# EAGLE board SVCSYNTH00 (EAGLE 7.7.0), part 1 of 2
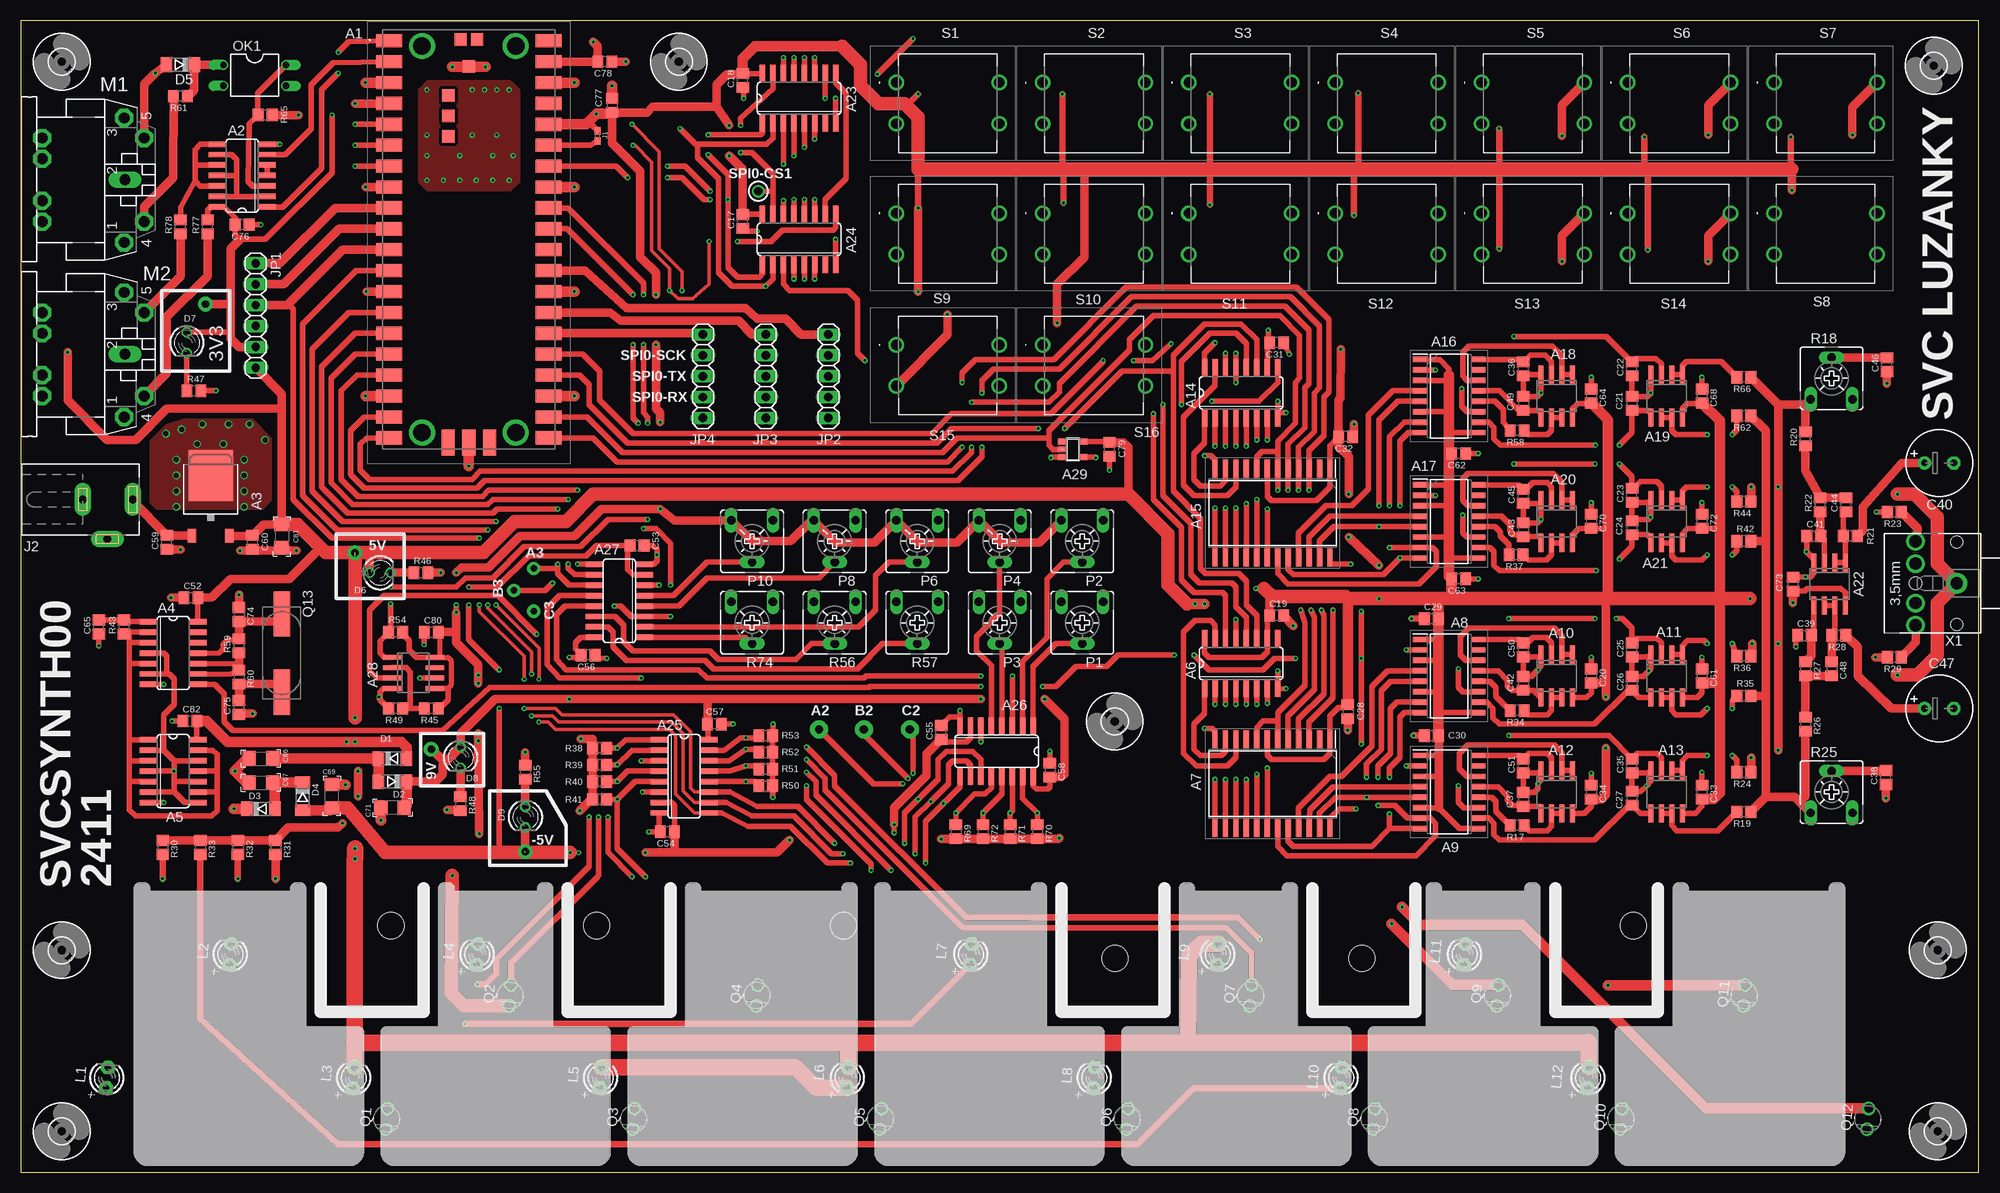
[diagram p4: board, top side]
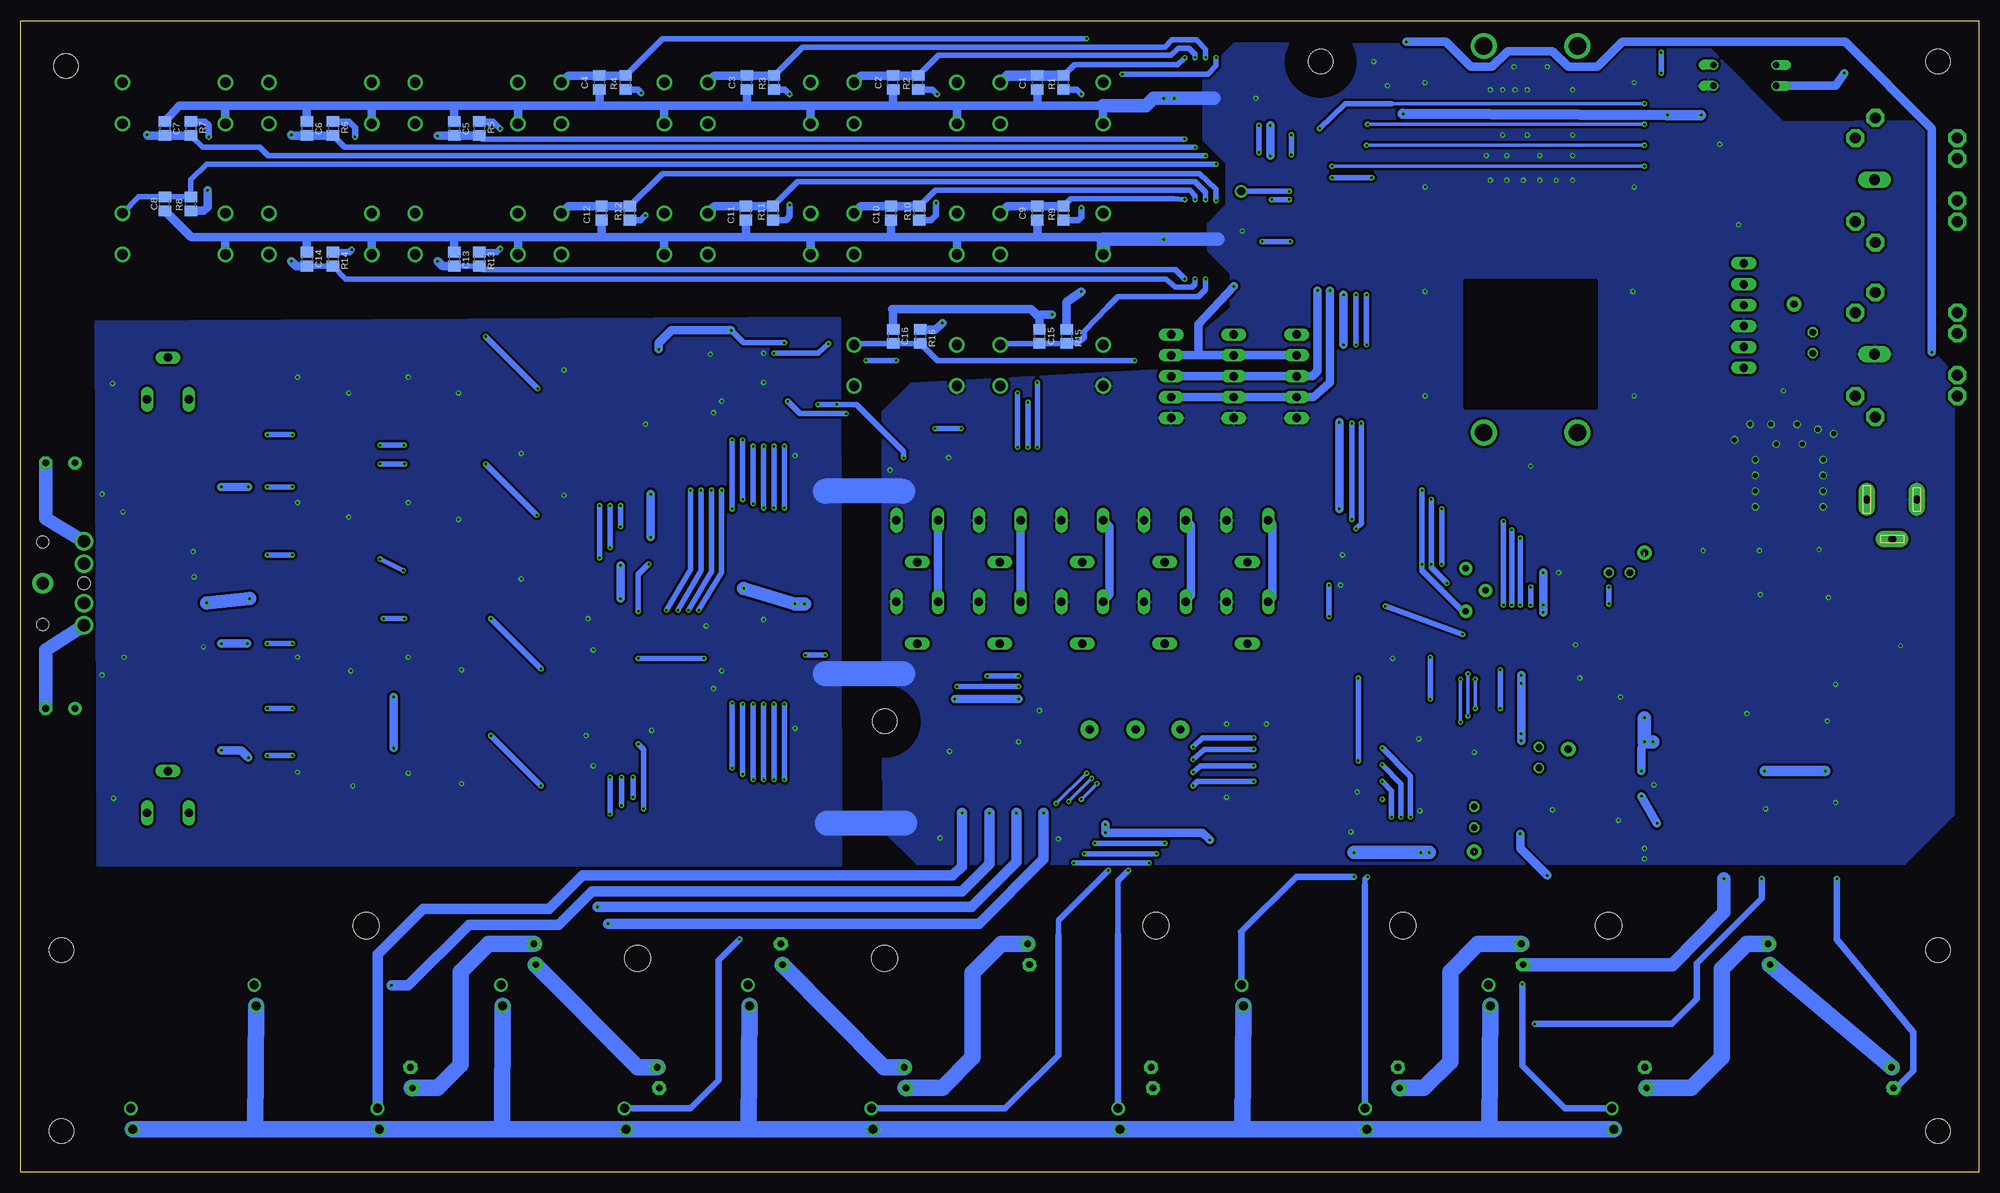
[diagram p5: board, bottom side, seen from below]

Size 238 x 140 mm. Coordinates in mm from the lower left corner, seen from the top.
Outline: 0,0 238,0 238,140 0,140 0,0
Copper layers (1*16): Top 0.035mm / dielectric 2mm / Bottom 0.035mm
Design rules "DesignRules_JLCPCB_2Layers_030_015": minimum track width 6mil, minimum drill 0.3mm, track to track 6mil, track to pad 6mil, pad to pad 6mil, via to via 6mil, smd to smd 6mil, copper to edge 0.5mm, drill to drill 0.5mm, minimum pad ring 0.15mm, minimum via ring 0.15mm, stop-mask expansion 2mil, vias tented up to drill 0mil, thermal gap 10mil
Holes 3.2 mm at 45,30 70,30 100,30 133,26 163,26 196,30
bRestrict: area 46.6,93 to 62.4,108.3

## Footprints (pad centres in the part's own frame; a part is rotated, then mirrored left to right if it is on the bottom)
PICO = smd 3.2 x 1.6: 1 -9.69,24.13; 2 -9.69,21.59; 3 -9.69,19.05; 4 -9.69,16.51; 5 -9.69,13.97; 6 -9.69,11.43; 7 -9.69,8.89; 8 -9.69,6.35; 9 -9.69,3.81; 10 -9.69,1.27; 11 -9.69,-1.27; 12 -9.69,-3.81; 13 -9.69,-6.35; 14 -9.69,-8.89; 15 -9.69,-11.43; 16 -9.69,-13.97; 17 -9.69,-16.51; 18 -9.69,-19.05; 19 -9.69,-21.59; 20 -9.69,-24.13; 21 9.69,-24.13; 22 9.69,-21.59; 23 9.69,-19.05; 24 9.69,-16.51; 25 9.69,-13.97; 26 9.69,-11.43; 27 9.69,-8.89; 28 9.69,-6.35; 29 9.69,-3.81; 30 9.69,-1.27; 31 9.69,1.27; 32 9.69,3.81; 33 9.69,6.35; 34 9.69,8.89; 35 9.69,11.43; 36 9.69,13.97; 37 9.69,16.51; 38 9.69,19.05; 39 9.69,21.59; 40 9.69,24.13 | smd 1.6 x 3.2: D1 -2.54,-24.7; D2 0,-24.7; D3 2.54,-24.7 | drill 2.1 pad 3.15: MH1 -5.7,23.5; MH2 5.7,23.5; MH3 -5.7,-23.5; MH4 5.7,-23.5 | smd 1.5 x 1.5: TP1 0,21; TP2 1,24.3; TP3 -1,24.3; TP4 -2.5,17.5; TP5 -2.5,15; TP6 -2.5,12.5
SO14 = smd 0.66 x 2.032: 1 -3.81,-3.073; 2 -2.54,-3.073; 3 -1.27,-3.073; 4 0,-3.073; 5 1.27,-3.073; 6 2.54,-3.073; 7 3.81,-3.073; 8 3.81,3.073; 9 2.54,3.073; 10 1.27,3.073; 11 0,3.073; 12 -1.27,3.073; 13 -2.54,3.073; 14 -3.81,3.073
TO252 = smd 1 x 1.6: 1 -2.28,-4.8; 2 2.28,-4.8 | smd 5.4 x 6.2: 3 0,2.5
SO16 = smd 0.66 x 2.032: 1 -4.445,-3.073; 2 -3.175,-3.073; 3 -1.905,-3.073; 4 -0.635,-3.073; 5 0.635,-3.073; 6 1.905,-3.073; 7 3.175,-3.073; 8 4.445,-3.073; 9 4.445,3.073; 10 3.175,3.073; 11 1.905,3.073; 12 0.635,3.073; 13 -0.635,3.073; 14 -1.905,3.073; 15 -3.175,3.073; 16 -4.445,3.073
SOIC127P1180X250-24N = smd 2.15 x 0.65: 1 -5.4,6.985; 2 -5.4,5.715; 3 -5.4,4.445; 4 -5.4,3.175; 5 -5.4,1.905; 6 -5.4,0.635; 7 -5.4,-0.635; 8 -5.4,-1.905; 9 -5.4,-3.175; 10 -5.4,-4.445; 11 -5.4,-5.715; 12 -5.4,-6.985; 13 5.4,-6.985; 14 5.4,-5.715; 15 5.4,-4.445; 16 5.4,-3.175; 17 5.4,-1.905; 18 5.4,-0.635; 19 5.4,0.635; 20 5.4,1.905; 21 5.4,3.175; 22 5.4,4.445; 23 5.4,5.715; 24 5.4,6.985
SOIC127P780X230-16N = smd 1.775 x 0.65: 1 -3.538,4.445; 2 -3.538,3.175; 3 -3.538,1.905; 4 -3.538,0.635; 5 -3.538,-0.635; 6 -3.538,-1.905; 7 -3.538,-3.175; 8 -3.538,-4.445; 9 3.538,-4.445; 10 3.538,-3.175; 11 3.538,-1.905; 12 3.538,-0.635; 13 3.538,0.635; 14 3.538,1.905; 15 3.538,3.175; 16 3.538,4.445
SO08 = smd 0.6 x 2.2: 1 -1.905,-2.6; 2 -0.635,-2.6; 3 0.635,-2.6; 4 1.905,-2.6; 5 1.905,2.6; 6 0.635,2.6; 7 -0.635,2.6; 8 -1.905,2.6
SOT23-5 = smd 0.69 x 0.99: 1 -0.95,-1.29; 2 0,-1.29; 3 0.95,-1.29; 4 0.95,1.3; 5 -0.95,1.3
R0805 = smd 1.3 x 1.5: 1 -0.85,0; 2 0.85,0
E3,5-8 = drill 0.813 pad 1.6: + -1.778,0 | drill 0.813 pad 1.6 octagon: - 1.778,0
R1206 = smd 1.6 x 1.803: 1 -1.422,0; 2 1.422,0
SOD80C = smd 1.4 x 1.8: A 1.7,0; C -1.7,0
LED3MM = drill 0.813 octagon: A -1.27,0; K 1.27,0
R0402 = smd 0.925 x 0.74: 1 -0.6,0; 2 0.6,0
DCJ0303 = drill 1 pad 2 long: 1 0,3.1; 2 4.8,0; 3 0,-3
1X06 = drill 1.016 long: 1 -6.35,0; 2 -3.81,0; 3 -1.27,0; 4 1.27,0; 5 3.81,0; 6 6.35,0
1X05 = drill 1.016 long: 1 -5.08,0; 2 -2.54,0; 3 0,0; 4 2.54,0; 5 5.08,0
K_0.9_1.8 = drill 0.9 pad 1.8: 1 0,0
K_1.0_2.2 = drill 1 pad 2.184: 1 0,0
K_0.8_1.6 = drill 0.8 pad 1.6: 1 0,0
LED3MM' = drill 0.813 pad 1.676 octagon: A -1.27,0; K 1.27,0
CP-2350 = drill 1.321 pad 2.184 octagon: 1 7.62,12.58; 3 -7.52,12.58; 4 5.08,15.02; 5 -5.08,15.02; PE -2.54,2.62; PE1 -5.08,2.62; PE2 5.08,2.62; PE@ 2.54,2.62 | drill 1.321 long: 2 0,12.68
DIL04 = drill 0.813 offset: 1 -1.27,-3.81; 2 1.27,-3.81; 3 1.27,3.81; 4 -1.27,3.81
CA6V = drill 1.016 long: A -2.54,-2.54; E 2.54,-2.54; S 0,2.54
TEFT4300 = drill 1.09 pad 1.635: C -1.27,0; E 1.27,0
CSM-7X-DU = smd 5.5 x 2: 1 -4.75,0; 2 4.75,0
101TS6211T1603EV = drill 1.25 pad 1.875: T1 0,0; T2 12.5,0; T3 0,-5; T4 12.5,-5
3,0 = hole 3: 0,0
STX3100 = drill 1.5 pad 2.54: 1 2.7,-0.1 | drill 1.5: 2 7.7,5; 3 7.7,2.3; 4 7.7,-2.5; 5 7.7,-5.2 | hole 1.5: 2.7,4.9; 2.7,-5.1; 7.7,-0.1

## Placement (x,y rotation side)
A1  PICO  [PICO]  54.48,113.41 0 top
A2  74LS14D  [SO14]  26.92,121.16 90 top
A3  7805DT  [TO252]  23.11,82.17 0 top
A4  74LS14D  [SO14]  18.54,63.12 270 top
A5  74LS14D  [SO14]  18.54,48.77 270 top
A6  74HC595D  [SO16]  148.34,61.85 0 top
A7  YMF262-M  [SOIC127P1180X250-24N]  152.15,47.24 270 top
A8  YAC512-M  [SOIC127P780X230-16N]  173.61,60.33 0 top
A9  YAC512-M  [SOIC127P780X230-16N]  173.61,46.23 0 top
A10  RC4580  [SO08]  186.69,60.33 180 top
A11  RC4580  [SO08]  200.03,60.33 180 top
A12  RC4580  [SO08]  186.69,46.23 180 top
A13  RC4580  [SO08]  200.03,46.23 180 top
A14  74HC595D  [SO16]  148.34,94.74 0 top
A15  YMF262-M  [SOIC127P1180X250-24N]  152.15,80.14 270 top
A16  YAC512-M  [SOIC127P780X230-16N]  173.61,94.36 0 top
A17  YAC512-M  [SOIC127P780X230-16N]  173.61,79.12 0 top
A18  RC4580  [SO08]  186.69,94.36 180 top
A19  RC4580  [SO08]  200.03,94.36 180 top
A20  RC4580  [SO08]  186.69,79.12 180 top
A21  RC4580  [SO08]  200.03,79.12 180 top
A22  LM1458D  [SO08]  219.84,71.5 180 top
A23  74LS165D  [SO16]  94.61,130.56 0 top
A24  74LS165D  [SO16]  94.61,113.41 0 top
A25  4051D  [SO16]  80.64,48.13 270 top
A26  4051D  [SO16]  118.62,51.18 180 top
A27  4051D  [SO16]  72.77,69.47 90 top
A28  LM2903D  [SO08]  47.75,60.71 270 top
A29  74AHC1G14DBV  [SOT23-5]  127.89,87.88 270 top
C1  2n7  [R0805]  114.43,132.46 90 bottom
C2  2n7  [R0805]  131.95,132.46 90 bottom
C3  2n7  [R0805]  149.73,132.46 90 bottom
C4  2n7  [R0805]  167.64,132.46 90 bottom
C5  2n7  [R0805]  185.29,126.87 270 bottom
C6  2n7  [R0805]  203.2,126.87 270 bottom
C7  2n7  [R0805]  220.47,126.87 270 bottom
C8  2n7  [R0805]  220.47,117.73 90 bottom
C9  2n7  [R0805]  114.43,116.59 90 bottom
C10  2n7  [R0805]  132.21,116.59 90 bottom
C11  2n7  [R0805]  149.86,116.59 90 bottom
C12  2n7  [R0805]  167.39,116.59 90 bottom
C13  2n7  [R0805]  185.29,111 270 bottom
C14  2n7  [R0805]  203.2,111 270 bottom
C15  2n7  [R0805]  114.17,101.6 270 bottom
C16  2n7  [R0805]  131.95,101.6 270 bottom
C17  100n  [R0805]  87.76,115.57 90 top
C18  100n  [R0805]  87.76,132.72 90 top
C19  100n  [R0805]  152.65,67.69 180 top
C20  100n  [R0805]  190.88,60.33 270 top
C21  2n7  [R0805]  195.83,93.47 270 top
C22  2n7  [R0805]  195.83,97.66 90 top
C23  2n7  [R0805]  195.83,82.3 90 top
C24  2n7  [R0805]  195.83,78.36 270 top
C25  2n7  [R0805]  195.83,63.5 90 top
C26  2n7  [R0805]  195.83,59.44 270 top
C27  2n7  [R0805]  195.83,45.47 270 top
C28  100n  [R0805]  161.29,56.01 270 top
C29  100n  [R0805]  171.45,67.31 0 top
C30  100n  [R0805]  171.45,53.09 0 top
C31  100n  [R0805]  152.65,100.84 180 top
C32  100n  [R0805]  161.04,89.41 180 top
C33  100n  [R0805]  204.34,46.23 270 top
C34  100n  [R0805]  190.88,46.23 270 top
C35  2n7  [R0805]  195.83,49.4 90 top
C36  10u  [R0805]  182.63,97.66 90 top
C37  47p  [R0805]  182.63,45.34 270 top
C38  10u  [R0805]  226.69,48.01 90 top
C39  2n7  [R0805]  216.79,65.28 0 top
C40  [E3,5-8]  233.17,86.23 0 top
C41  2n7  [R0805]  217.93,77.34 0 top
C42  47p  [R0805]  182.63,59.44 270 top
C43  47p  [R0805]  182.63,78.11 270 top
C44  2n7  [R0805]  221.87,81.15 90 top
C45  10u  [R0805]  182.63,82.17 90 top
C46  10u  [R0805]  226.82,98.17 90 top
C47  [E3,5-8]  233.17,56.39 0 top
C48  2n7  [R0805]  220.09,61.21 270 top
C49  47p  [R0805]  182.63,93.47 270 top
C50  10u  [R0805]  182.63,63.5 90 top
C51  10u  [R0805]  182.63,49.4 90 top
C52  100n  [R0805]  20.7,69.85 0 top
C53  100n  [R0805]  74.93,76.2 0 top
C54  100n  [R0805]  78.61,41.4 180 top
C55  100n  [R0805]  111.89,53.47 90 top
C56  100n  [R0805]  68.96,62.87 180 top
C57  100n  [R0805]  84.33,54.48 180 top
C58  100n  [R0805]  125.09,48.9 270 top
C59  100n  [R0805]  17.78,76.58 90 top
C60  100n  [R0805]  28.19,76.58 90 top
C61  100n  [R0805]  204.34,60.33 270 top
C62  100n  [R0805]  174.75,87.38 180 top
C63  100n  [R0805]  174.75,72.14 180 top
C64  100n  [R0805]  190.88,94.36 270 top
C65  2n7  [R0805]  9.53,66.29 90 top
C66  10M  [R1206]  29.21,50.29 180 top
C67  10M  [R1206]  29.21,47.37 180 top
C68  100n  [R0805]  204.34,94.36 270 top
C69  10M  [R1206]  37.85,45.72 270 top
C70  100n  [R0805]  190.88,79.12 270 top
C71  10M  [R1206]  45.21,44.32 0 top
C72  100n  [R0805]  204.34,79.12 270 top
C73  100n  [R0805]  215.39,71.5 270 top
C74  20p  [R0805]  26.54,67.82 270 top
C75  20p  [R0805]  26.54,56.52 90 top
C76  100n  [R0805]  26.92,115.19 180 top
C77  100n  [R0805]  71.88,129.67 270 top
C78  100n  [R0805]  70.99,135 180 top
C79  100n  [R0805]  132.33,87.88 90 top
C80  100n  [R0805]  49.91,65.66 0 top
C81  10M  [R1206]  31.75,77.34 90 top
C82  100n  [R0805]  20.57,54.86 0 top
D1  LL4148  [SOD80C]  45.21,50.29 0 top
D2  LL4148  [SOD80C]  45.21,47.5 180 top
D3  LL4148  [SOD80C]  29.21,44.2 0 top
D4  LL4148  [SOD80C]  34.29,45.72 270 top
D5  LL4148  [SOD80C]  19.43,134.62 180 top
D6  [LED3MM]  43.69,72.9 0 top
D7  [LED3MM]  20.19,100.84 270 top
D8  [LED3MM]  53.47,50.42 270 top
D9  [LED3MM]  61.34,43.18 270 top
J1  [R0402]  70.1,125.98 90 top
J2  [DCJ0303]  10.54,81.79 270 top
JP1  [1X06]  28.57,104.14 270 top
JP2  [1X05]  98.17,96.77 90 top
JP3  [1X05]  90.55,96.77 90 top
JP4  [1X05]  82.93,96.77 90 top
K1  [K_0.9_1.8]  40.64,75.31 0 top
K2  [K_0.9_1.8]  49.91,51.44 0 top
K3  [K_0.9_1.8]  61.34,38.99 0 top
K4  [K_0.9_1.8]  22.48,105.54 0 top
K5  [K_1.0_2.2]  97.03,53.85 0 top
K6  [K_1.0_2.2]  108.08,53.85 0 top
K7  [K_1.0_2.2]  102.49,53.85 0 top
K8  [K_0.8_1.6]  62.36,73.41 0 top
K9  [K_0.8_1.6]  59.94,70.74 0 top
K10  [K_0.8_1.6]  62.36,68.2 0 top
L1  [LED3MM']  10.5,11.5 85 top
L2  [LED3MM']  25.5,26.5 85 top
L3  [LED3MM']  40.5,11.5 85 top
L4  [LED3MM']  55.5,26.5 85 top
L5  [LED3MM']  70.5,11.5 85 top
L6  [LED3MM']  100.5,11.5 85 top
L7  [LED3MM']  115.5,26.5 85 top
L8  [LED3MM']  130.5,11.5 85 top
L9  [LED3MM']  145.5,26.5 85 top
L10  [LED3MM']  160.5,11.5 85 top
L11  [LED3MM']  175.5,26.5 85 top
L12  [LED3MM']  190.5,11.5 85 top
M1  MIDIJACK  [CP-2350]  0,120.65 270 top
M2  MIDIJACK  [CP-2350]  0,99.44 270 top
OK1  PC817  [DIL04]  28.45,133.35 270 top
P1  10k  [CA6V]  129.03,66.8 180 top
P2  10k  [CA6V]  129.03,76.71 180 top
P3  10k  [CA6V]  119,66.8 180 top
P4  10k  [CA6V]  119,76.71 180 top
P6  10k  [CA6V]  108.97,76.71 180 top
P8  10k  [CA6V]  98.93,76.71 180 top
P10  10k  [CA6V]  88.9,76.71 180 top
Q1  TEFT4300  [TEFT4300]  44.5,6.5 85 top
Q2  TEFT4300  [TEFT4300]  59.5,21.5 85 top
Q3  TEFT4300  [TEFT4300]  74.5,6.5 85 top
Q4  TEFT4300  [TEFT4300]  89.5,21.5 85 top
Q5  TEFT4300  [TEFT4300]  104.5,6.5 85 top
Q6  TEFT4300  [TEFT4300]  134.5,6.5 85 top
Q7  TEFT4300  [TEFT4300]  149.5,21.5 85 top
Q8  TEFT4300  [TEFT4300]  164.5,6.5 85 top
Q9  TEFT4300  [TEFT4300]  179.5,21.5 85 top
Q10  TEFT4300  [TEFT4300]  194.5,6.5 85 top
Q11  TEFT4300  [TEFT4300]  209.5,21.5 85 top
Q12  TEFT4300  [TEFT4300]  224.5,6.5 85 top
Q13  14.31818M-SMDHC49S  [CSM-7X-DU]  31.75,63.12 270 top
R1  10k  [R0805]  111.25,132.46 90 bottom
R2  10k  [R0805]  128.91,132.46 90 bottom
R3  10k  [R0805]  146.43,132.46 90 bottom
R4  10k  [R0805]  164.47,132.46 90 bottom
R5  10k  [R0805]  182.25,126.87 270 bottom
R6  10k  [R0805]  200.03,126.87 270 bottom
R7  10k  [R0805]  217.3,126.87 270 bottom
R8  10k  [R0805]  217.3,117.73 90 bottom
R9  10k  [R0805]  111.25,116.59 90 bottom
R10  10k  [R0805]  128.78,116.59 90 bottom
R11  10k  [R0805]  146.56,116.59 90 bottom
R12  10k  [R0805]  163.96,116.59 90 bottom
R13  10k  [R0805]  182.25,111 270 bottom
R14  10k  [R0805]  200.03,111 270 bottom
R15  10k  [R0805]  110.87,101.6 270 bottom
R16  10k  [R0805]  128.65,101.6 270 bottom
R17  33  [R0805]  181.86,42.16 180 top
R18  10k  [CA6V]  220.09,96.52 0 top
R19  10k  [R0805]  209.42,43.81 180 top
R20  4k7  [R0805]  216.92,89.15 90 top
R21  100  [R0805]  222.38,77.34 180 top
R22  4k7  [R0805]  218.69,81.15 90 top
R23  100  [R0805]  227.71,80.26 180 top
R24  10k  [R0805]  209.42,48.64 180 top
R25  10k  [CA6V]  220.09,46.23 0 top
R26  4k7  [R0805]  216.92,54.48 270 top
R27  4k7  [R0805]  216.92,61.21 270 top
R28  100  [R0805]  220.98,65.28 180 top
R29  100  [R0805]  227.71,62.61 180 top
R30  1k  [R0805]  17.27,39.5 270 top
R31  1k  [R0805]  30.99,39.5 270 top
R32  1k  [R0805]  26.42,39.5 270 top
R33  1k  [R0805]  21.84,39.5 270 top
R34  33  [R0805]  181.86,56.13 180 top
R35  10k  [R0805]  209.42,57.91 180 top
R36  10k  [R0805]  209.42,62.74 180 top
R37  33  [R0805]  181.74,75.06 180 top
R38  10k  [R0805]  70.36,51.56 180 top
R39  10k  [R0805]  70.36,49.53 180 top
R40  10k  [R0805]  70.36,47.5 180 top
R41  10k  [R0805]  70.36,45.34 180 top
R42  10k  [R0805]  209.42,76.71 180 top
R43  10k  [R0805]  12.57,66.29 90 top
R44  10k  [R0805]  209.42,81.53 180 top
R45  1k  [R0805]  49.91,56.39 180 top
R46  10k  [R0805]  48.64,72.9 0 top
R47  10k  [R0805]  21.08,95 0 top
R48  10k  [R0805]  53.47,44.83 270 top
R49  1k  [R0805]  45.59,56.39 180 top
R50  10k  [R0805]  90.55,46.99 0 top
R51  10k  [R0805]  90.55,49.02 0 top
R52  10k  [R0805]  90.55,51.05 0 top
R53  10k  [R0805]  90.55,53.09 0 top
R54  1k  [R0805]  45.59,65.66 180 top
R55  10k  [R0805]  61.34,48.64 270 top
R56  10k  [CA6V]  98.93,66.8 180 top
R57  10k  [CA6V]  108.97,66.8 180 top
R58  33  [R0805]  181.86,90.17 180 top
R59  1M  [R0805]  26.54,64.01 90 top
R60  470  [R0805]  26.54,60.2 270 top
R61  100  [R0805]  19.43,130.81 180 top
R62  10k  [R0805]  209.42,91.95 180 top
R65  10k  [R0805]  29.72,128.52 180 top
R66  10k  [R0805]  209.42,96.65 180 top
R69  10k  [R0805]  113.67,41.4 270 top
R70  10k  [R0805]  123.57,41.4 270 top
R71  10k  [R0805]  120.27,41.4 270 top
R72  10k  [R0805]  116.97,41.4 270 top
R74  10k  [CA6V]  88.9,66.8 180 top
R77  100  [R0805]  22.73,114.94 90 top
R78  100  [R0805]  19.43,114.94 90 top
S1  101-TS6211T1603-EV  [101TS6211T1603EV]  106.43,132.46 0 top
S2  101-TS6211T1603-EV  [101TS6211T1603EV]  124.21,132.46 0 top
S3  101-TS6211T1603-EV  [101TS6211T1603EV]  141.99,132.46 0 top
S4  101-TS6211T1603-EV  [101TS6211T1603EV]  159.77,132.46 0 top
S5  101-TS6211T1603-EV  [101TS6211T1603EV]  177.55,132.46 0 top
S6  101-TS6211T1603-EV  [101TS6211T1603EV]  195.33,132.46 0 top
S7  101-TS6211T1603-EV  [101TS6211T1603EV]  213.11,132.46 0 top
S8  101-TS6211T1603-EV  [101TS6211T1603EV]  213.11,116.59 0 top
S9  101-TS6211T1603-EV  [101TS6211T1603EV]  106.43,116.59 0 top
S10  101-TS6211T1603-EV  [101TS6211T1603EV]  124.21,116.59 0 top
S11  101-TS6211T1603-EV  [101TS6211T1603EV]  141.99,116.59 0 top
S12  101-TS6211T1603-EV  [101TS6211T1603EV]  159.77,116.59 0 top
S13  101-TS6211T1603-EV  [101TS6211T1603EV]  177.55,116.59 0 top
S14  101-TS6211T1603-EV  [101TS6211T1603EV]  195.33,116.59 0 top
S15  101-TS6211T1603-EV  [101TS6211T1603EV]  106.43,100.58 0 top
S16  101-TS6211T1603-EV  [101TS6211T1603EV]  124.21,100.58 0 top
U$8  [3,0]  5,5 0 top
U$10  [3,0]  5,27 0 top
U$11  [3,0]  5,135 0 top
U$13  [3,0]  233,5 0 top
U$14  [3,0]  80,135 0 top
U$15  [3,0]  232.5,134.5 0 top
U$17  [3,0]  233,27 0 top
U$18  [3,0]  132.97,54.81 0 top
X1  STEREOJACK  [STX3100]  238,71.5 180 top